# EAGLE design M628A (EAGLE 6.6.0)
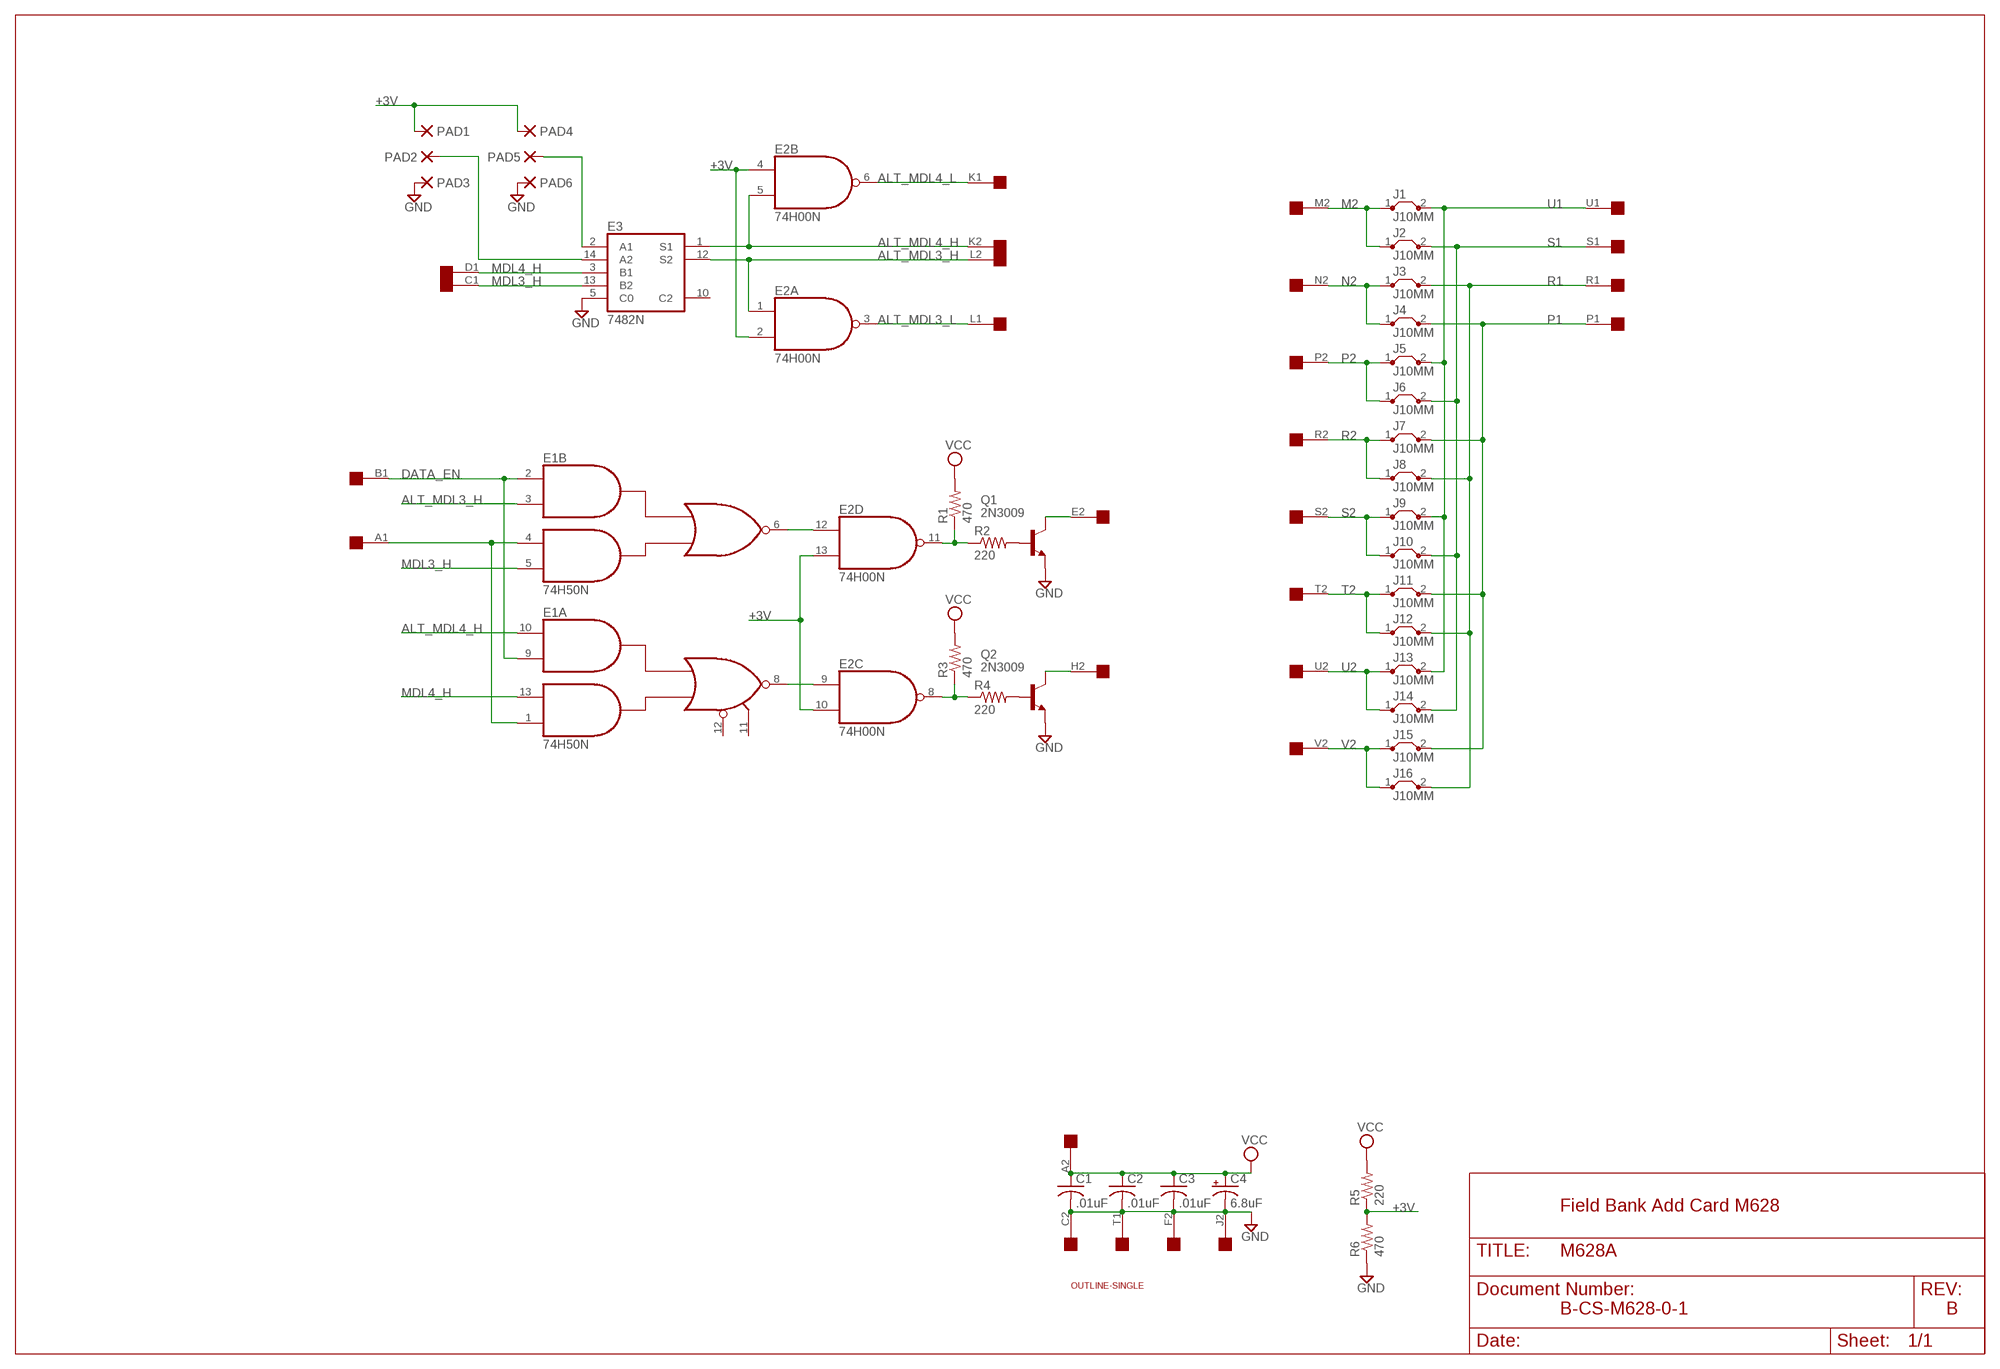
[diagram p0: schematic, sheet 1]

## Parts
C1  .01uF  C-US050-025X075  [C050-025X075]
C2  .01uF  C-US050-025X075  [C050-025X075]
C3  .01uF  C-US050-025X075  [C050-025X075]
C4  6.8uF  CPOL-USE20-8AXIAL  [E12-8]
E1  74H50N  7450N  [DIL14]
E2  74H00N  7400N  [DIL14]
E3  7482N  [DIL14]
J1  J10MM  [10]
J2  J10MM  [10]
J3  J10MM  [10]
J4  J10MM  [10]
J5  J10MM  [10]
J6  J10MM  [10]
J7  J10MM  [10]
J8  J10MM  [10]
J9  J10MM  [10]
J10  J10MM  [10]
J11  J10MM  [10]
J12  J10MM  [10]
J13  J10MM  [10]
J14  J10MM  [10]
J15  J10MM  [10]
J16  J10MM  [10]
PAD1  PAD-0420  [0420]
PAD2  PAD-0420  [0420]
PAD3  PAD-0420  [0420]
PAD4  PAD-0420  [0420]
PAD5  PAD-0420  [0420]
PAD6  PAD-0420  [0420]
Q1  2N3009  2N2102  [TO5]
Q2  2N3009  2N2102  [TO5]
R1  470  R-US_0207/10  [0207/10]
R2  220  R-US_0207/10  [0207/10]
R3  470  R-US_0207/10  [0207/10]
R4  220  R-US_0207/10  [0207/10]
R5  220  R-US_0207/10  [0207/10]
R6  470  R-US_0207/10  [0207/10]
U$1  OUTLINE-SINGLE  [SINGLE]
U$2  SINGLE  [EDGE-CON2]

## Nets
+3V [Supply]: E2.2(A:I1) E2.4(B:I0) E2.10(C:I1) E2.13(D:I1) PAD1.P$1(P) PAD4.P$1(P) R5.1 R6.2
ALT_MDL3_H: E1.3(B:I2) E2.1(A:I0) E3.12(S2) U$2.L2
ALT_MDL3_L: E2.3(A:O) U$2.L1
ALT_MDL4_H: E1.10(A:I1) E2.5(B:I1) E3.1(S1) U$2.K2
ALT_MDL4_L: E2.6(B:O) U$2.K1
DATA_EN: E1.2(B:I1) E1.9(A:I2) U$2.B1
GND [Supply]: C1.2 C2.2 C3.2 C4.- E3.5(C0) PAD3.P$1(P) PAD6.P$1(P) Q1.1(E) Q2.1(E) R6.1 U$2.C2 U$2.F2 U$2.J2 U$2.T1
M2: J1.1 J2.1 U$2.M2
MDL3_H: E1.5(B:I4) E3.13(B2) U$2.C1
MDL4_H: E1.13(A:I3) E3.3(B1) U$2.D1
N2: J3.1 J4.1 U$2.N2
N$1: E3.2(A1) PAD5.P$1(P)
N$2: E3.14(A2) PAD2.P$1(P)
N$3: E1.8(A:O) E2.9(C:I0)
N$4: E1.1(A:I4) E1.4(B:I3) U$2.A1
N$5: E1.6(B:O) E2.12(D:I0)
N$6: E2.11(D:O) R1.1 R2.1
N$7: E2.8(C:O) R3.1 R4.1
N$8: Q1.2(B) R2.2
N$9: Q2.2(B) R4.2
N$10: Q1.3(C) U$2.E2
N$11: Q2.3(C) U$2.H2
P1: J4.2 J7.2 J11.2 J15.2 U$2.P1
P2: J5.1 J6.1 U$2.P2
R1: J3.2 J8.2 J12.2 J16.2 U$2.R1
R2: J7.1 J8.1 U$2.R2
S1: J2.2 J6.2 J10.2 J14.2 U$2.S1
S2: J9.1 J10.1 U$2.S2
T2: J11.1 J12.1 U$2.T2
U1: J1.2 J5.2 J9.2 J13.2 U$2.U1
U2: J13.1 J14.1 U$2.U2
V2: J15.1 J16.1 U$2.V2
VCC [Supply]: C1.1 C2.1 C3.1 C4.+ R1.2 R3.2 R5.2 U$2.A2
Unconnected: E1.11(A:I6) E1.12(A:I5) E3.6 E3.7 E3.8 E3.9 E3.10(C2) U$2.B2 U$2.D2 U$2.E1 U$2.F1 U$2.H1 U$2.J1 U$2.M1 U$2.N1 U$2.V1

## Notes on the sheet
- Field Bank Add Card M628
- B-CS-M628-0-1 | B

## Power pins joined to a net without a drawn wire
GND: E1.7(P:GND) E2.7(P:GND) E3.11(GND)
VCC: E1.14(P:VCC) E2.14(P:VCC) E3.4(VCC)

## Library data of the parts
C1-C3 = rcl:C-US: CAPACITOR, American symbol
C4 = dec-con:CPOL-USE20-8AXIAL: A 0.8 inch electrolytic.
E1 = dec-con:74*50: 4-2-3-2 input AND OR INVERTER gates
E2 = 74xx-us:74*00: Quad 2-input NAND gate
E3 = dec-con:74*82: 2-bit binary full ADDER Has the wrong GND pin in other libraries.
J1-J16 = jumper:J: Bridge
PAD1-PAD6 = dec-con:PAD: WIRE PAD Standard US Drill Sizes
Q1 Q2 = transistor-npn:2N2102: NPN Transistor
R1-R6 = rcl:R-US_: RESISTOR, American symbol
U$1 = dec-con:OUTLINE-*: Board outlines for DEC boards.
U$2 = dec-con:SINGLE: Single-Height DEC board

## Net classes
1 Supply: width 0.813 mm

## Board
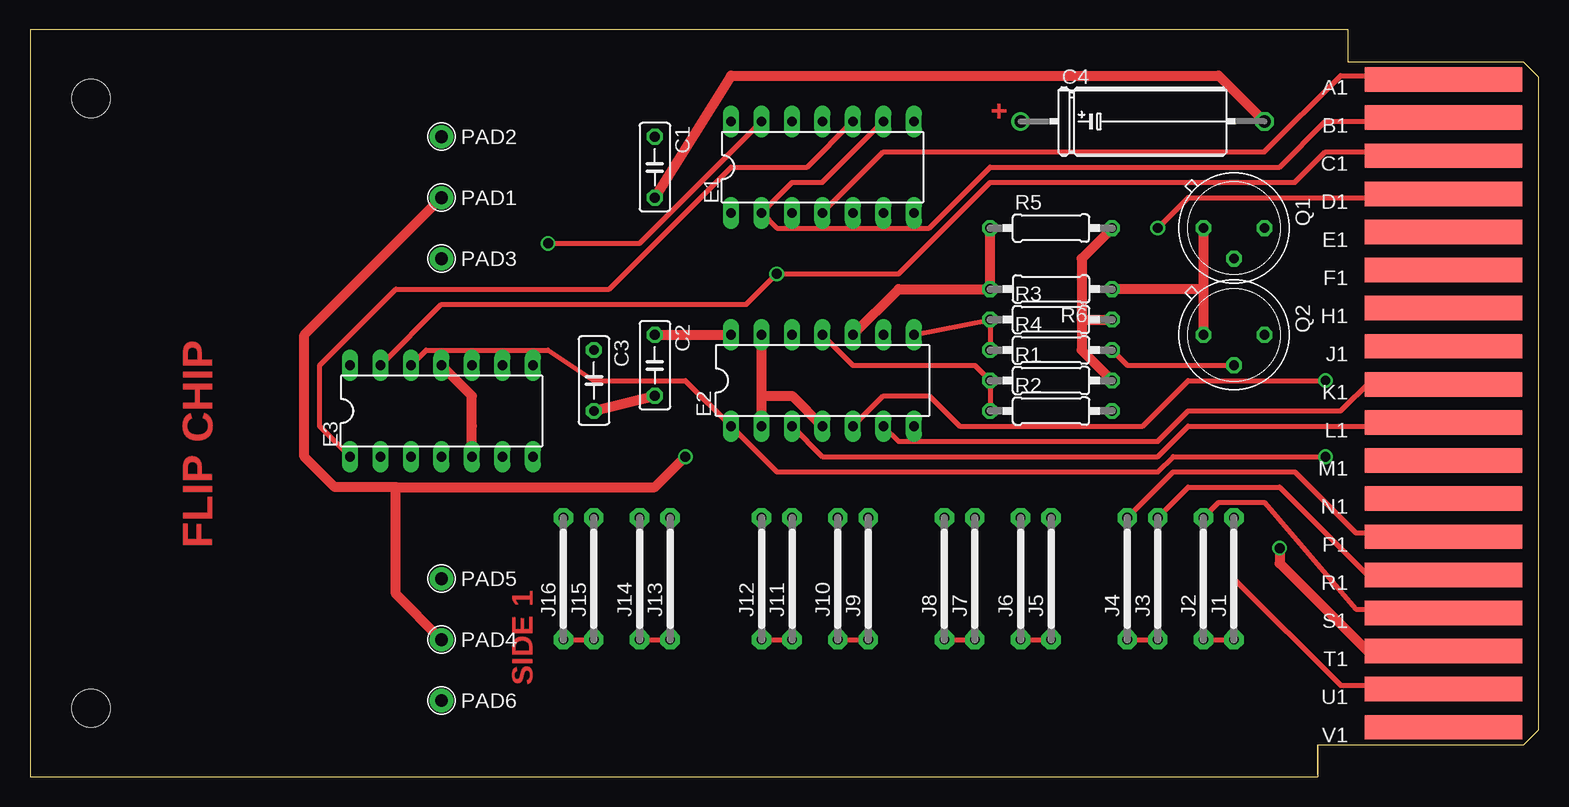
[diagram p1: board, top side]
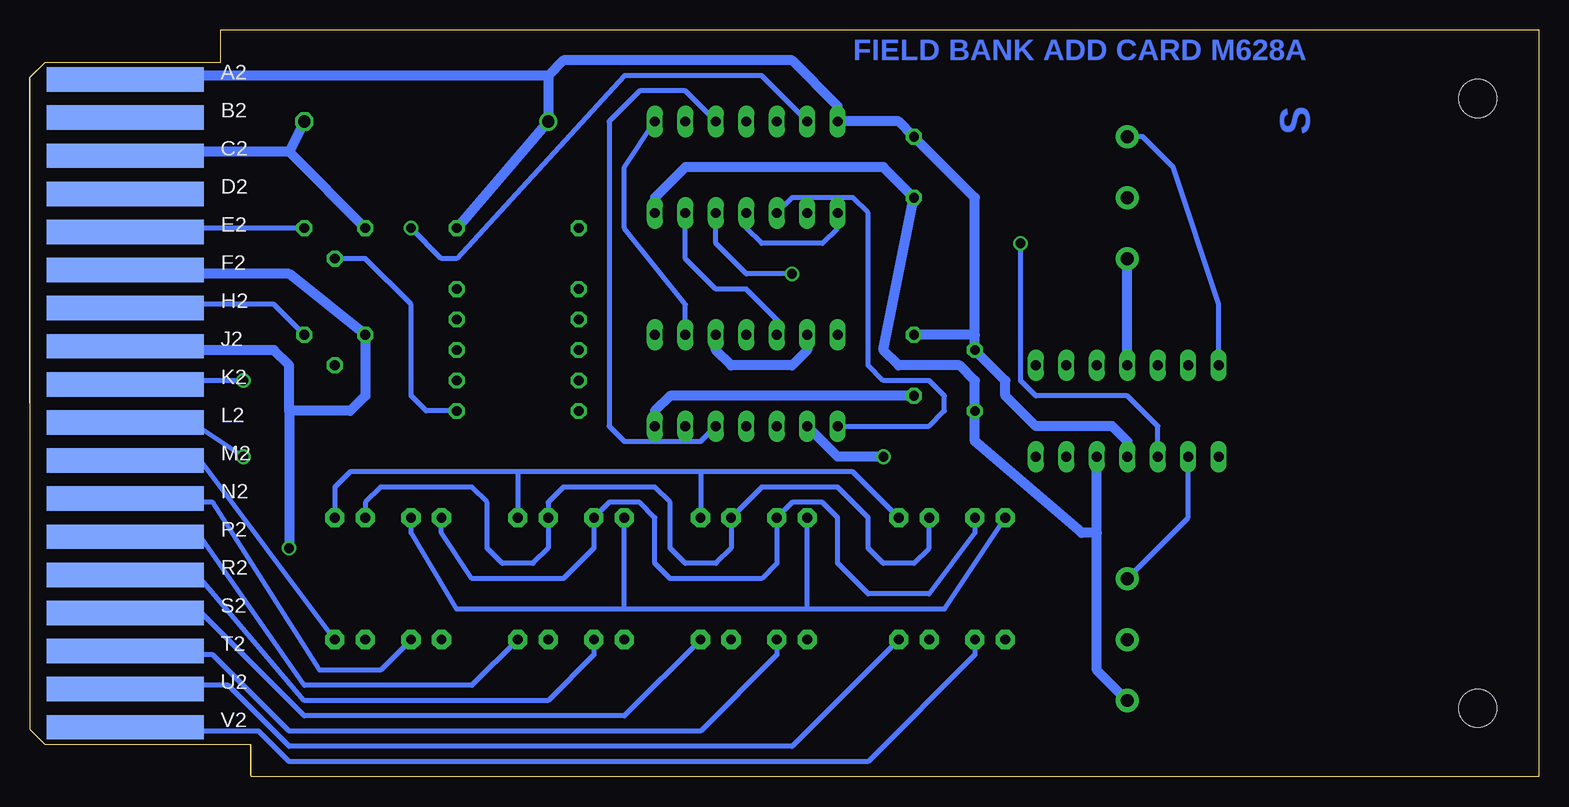
[diagram p2: board, bottom side, seen from below]

Size 125.73 x 62.23 mm. Coordinates in mm from the lower left corner, seen from the top.
Copper layers (1+16): Top 0.035mm / dielectric 1.5mm / Bottom 0.035mm
Design rules "16mils": minimum track width 16mil, minimum drill 32mil, track to track 15mil, track to pad 10mil, pad to pad 10mil, via to via 10mil, smd to smd 10mil, copper to edge 13mil, drill to drill 10mil, minimum pad ring 10mil, minimum via ring 8mil, stop-mask expansion 0mil, vias tented up to drill 0mil, thermal gap 10mil

### Footprints (pad centres in the part's own frame; a part is rotated, then mirrored left to right if it is on the bottom)
C050-025X075 = drill 0.813 octagon: 1 -2.54,0; 2 2.54,0
E12-8 = drill 1.016: + -10.16,0 | drill 1.016 octagon: - 10.16,0
DIL14 = drill 0.813 long: 1 -7.62,-3.81; 2 -5.08,-3.81; 3 -2.54,-3.81; 4 0,-3.81; 5 2.54,-3.81; 6 5.08,-3.81; 7 7.62,-3.81; 8 7.62,3.81; 9 5.08,3.81; 10 2.54,3.81; 11 0,3.81; 12 -2.54,3.81; 13 -5.08,3.81; 14 -7.62,3.81
10 = drill 0.813 pad 1.6 octagon: 1 -5.08,0; 2 5.08,0
0420 = drill 1.067 pad 1.93: P$1 0,0
TO5 = drill 0.813 octagon: 1 0,-2.54; 2 2.54,0; 3 0,2.54
0207/10 = drill 0.813 octagon: 1 -5.08,0; 2 5.08,0
SINGLE = hole 3.175: 120.65,56.515; 120.65,5.715
EDGE-CON2 = smd 13.106 x 2.032: A1 7.938,4.128; B1 7.938,7.303; C1 7.938,10.477; D1 7.938,13.652; E1 7.938,16.828; F1 7.938,20.003; H1 7.938,23.177; J1 7.938,26.352; K1 7.938,29.527; L1 7.938,32.703; M1 7.938,35.877; N1 7.938,39.053; P1 7.938,42.227; R1 7.938,45.403; S1 7.938,48.578; T1 7.938,51.752; U1 7.938,54.928; V1 7.938,58.102 | smd 13.106 x 2.032 bottom: A2 7.938,4.128; B2 7.938,7.303; C2 7.938,10.477; D2 7.938,13.652; E2 7.938,16.828; F2 7.938,20.003; H2 7.938,23.177; J2 7.938,26.352; K2 7.938,29.527; L2 7.938,32.703; M2 7.938,35.877; N2 7.938,39.053; P2 7.938,42.227; R2 7.938,45.403; S2 7.938,48.578; T2 7.938,51.752; U2 7.938,54.928; V2 7.938,58.102

### Placement (x,y rotation side)
C1  52.07,50.8 270 top
C2  52.07,34.29 270 top
C3  46.99,33.02 270 top
C4  92.71,54.61 0 top
E1  66.04,50.8 0 top
E2  66.04,33.02 0 top
E3  34.29,30.48 0 top
J1  100.33,16.51 90 top
J2  97.79,16.51 90 top
J3  93.98,16.51 90 top
J4  91.44,16.51 90 top
J5  85.09,16.51 90 top
J6  82.55,16.51 90 top
J7  78.74,16.51 90 top
J8  76.2,16.51 90 top
J9  69.85,16.51 90 top
J10  67.31,16.51 90 top
J11  63.5,16.51 90 top
J12  60.96,16.51 90 top
J13  53.34,16.51 90 top
J14  50.8,16.51 90 top
J15  46.99,16.51 90 top
J16  44.45,16.51 90 top
PAD1  34.29,48.26 0 top
PAD2  34.29,53.34 0 top
PAD3  34.29,43.18 0 top
PAD4  34.29,11.43 0 top
PAD5  34.29,16.51 0 top
PAD6  34.29,6.35 0 top
Q1  100.33,45.72 270 top
Q2  100.33,36.83 270 top
R1  85.09,33.02 0 top
R2  85.09,30.48 0 top
R3  85.09,38.1 0 top
R4  85.09,35.56 0 top
R5  85.09,45.72 0 top
R6  85.09,40.64 180 top
U$1  125.73,62.23 180 top
U$2  125.73,62.23 180 top
U$3  [FLIPCHIP]  10.16,0 0 top

### Tracks (layer width: path | path; a pad name or v marks a point on that pad's centre or on a via)
+3V  (via drill 0.81)
  Top 0.813: E2.10 72.39,40.64 R6.2 R5.1 | v54.61,26.67 52.07,24.13 30.48,24.13 | 30.48,24.13 25.4,24.13 22.86,26.67 22.86,36.83 PAD1.P$1 | PAD4.P$1 30.48,15.24 30.48,24.13 | E2.2 60.96,31.75 | 60.96,31.75 E2.13 | E2.4 63.5,31.75 60.96,31.75
  Bottom 0.813: E2.2 58.42,26.67 v54.61,26.67 | E2.13 60.96,35.56 62.23,34.29 67.31,34.29 68.58,35.56 E2.10
ALT_MDL3_H  (via drill 0.81)
  Top 0.406: E3.12 33.02,35.56 43.18,35.56 46.99,33.02 54.61,33.02 E2.1 62.23,25.4 93.98,25.4 95.25,26.67 v107.95,26.67
  Bottom 0.406: E2.1 50.8,29.21 49.53,30.48 49.53,31.75 50.8,33.02 54.61,33.02 55.88,34.29 55.88,46.99 57.15,48.26 62.23,48.26 E1.3 | U$2.L2 116.84,29.21 111.76,29.21 v107.95,26.67
ALT_MDL3_L
  Top 0.406: U$2.L1 116.84,29.21 96.52,29.21 93.98,26.67 66.04,26.67 E2.3
ALT_MDL4_H  (via drill 0.81)
  Top 0.406: E3.1 24.13,29.21 24.13,34.29 30.48,40.64 48.26,40.64 58.42,50.8 64.77,50.8 E1.10 | v107.95,33.02 96.52,33.02 92.71,29.21 77.47,29.21 74.93,31.75 71.12,31.75 E2.5
  Bottom 0.406: E1.10 71.12,57.15 74.93,57.15 77.47,54.61 77.47,29.21 76.2,27.94 69.85,27.94 E2.5 | U$2.K2 116.84,33.02 v107.95,33.02
ALT_MDL4_L
  Top 0.406: U$2.K1 116.84,33.02 111.76,33.02 109.22,30.48 96.52,30.48 93.98,27.94 72.39,27.94 E2.6
DATA_EN
  Top 0.406: U$2.B1 116.84,54.61 107.95,54.61 104.14,50.8 80.01,50.8 74.93,45.72 62.23,45.72 E1.2 63.5,49.53 66.04,49.53 E1.9
GND  (via drill 0.81)
  Top 0.813: U$2.T1 116.84,10.16 111.76,10.16 104.14,17.78 v104.14,19.05 | C4.- 99.06,58.42 58.42,58.42 C1.2 | Q1.1 97.79,40.64 | 97.79,40.64 Q2.1 | 97.79,40.64 R6.1 | C3.2 C2.2 | E3.11 36.83,31.75 36.83,29.21 E3.5
  Bottom 0.813: U$2.F2 116.84,41.91 104.14,41.91 Q2.1 97.79,31.75 99.06,30.48 104.14,30.48 | 104.14,30.48 v104.14,19.05 | U$2.J2 116.84,35.56 105.41,35.56 104.14,34.29 104.14,30.48 | U$2.C2 116.84,52.07 104.14,52.07 | 104.14,52.07 Q1.1 | C4.- 104.14,52.07 | 36.83,20.32 36.83,8.89 PAD6.P$1 | 36.83,20.32 E3.5 | 36.83,20.32 38.1,20.32 46.99,27.94 C3.2 46.99,33.02 48.26,34.29 53.34,34.29 54.61,35.56 C1.2 54.61,50.8 71.12,50.8 73.66,48.26 E1.7 | E2.7 73.66,30.48 72.39,31.75 C2.2 | E3.11 PAD3.P$1
M2
  Top 0.406: J2.1 J1.1
  Bottom 0.406: U$2.M2 116.84,26.67 111.76,26.67 J1.1
MDL3_H  (via drill 0.81)
  Top 0.406: E3.13 34.29,39.37 59.69,39.37 v62.23,41.91 72.39,41.91 80.01,49.53 105.41,49.53 107.95,52.07 116.84,52.07 U$2.C1
  Bottom 0.406: E1.5 68.58,44.45 66.04,41.91 v62.23,41.91
MDL4_H  (via drill 0.81)
  Top 0.406: v43.18,44.45 50.8,44.45 E1.13 | U$2.D1 116.84,48.26 96.52,48.26 v93.98,45.72
  Bottom 0.406: E3.3 31.75,29.21 34.29,31.75 41.91,31.75 43.18,33.02 v43.18,44.45 | E1.13 64.77,58.42 76.2,58.42 90.17,43.18 91.44,43.18 v93.98,45.72
N2
  Top 0.406: J4.1 J3.1
  Bottom 0.406: J3.1 96.52,8.89 101.6,8.89 110.49,22.86 116.84,22.86 U$2.N2
N$1
  Bottom 0.406: PAD5.P$1 29.21,21.59 E3.2
N$2
  Bottom 0.406: PAD2.P$1 33.02,53.34 30.48,50.8 26.67,39.37 E3.14
N$3
  Bottom 0.406: E2.9 71.12,39.37 76.2,45.72 76.2,50.8 E1.8
N$4
  Top 0.406: U$2.A1 116.84,58.42 109.22,58.42 102.87,52.07 71.12,52.07 E1.4
  Bottom 0.406: E1.1 58.42,45.72 59.69,44.45 64.77,44.45 66.04,45.72 E1.4
N$5
  Bottom 0.406: E2.12 63.5,38.1 66.04,40.64 68.58,40.64 71.12,43.18 E1.6
N$6
  Top 0.406: R2.1 R1.1 78.74,34.29 68.58,34.29 E2.11
N$7
  Top 0.406: E2.8 R3.1 R4.1
N$8
  Bottom 0.406: R2.2 92.71,30.48 93.98,31.75 93.98,39.37 97.79,43.18 Q1.2
N$9
  Top 0.406: R4.2 91.44,34.29 Q2.2
N$10
  Bottom 0.406: U$2.E2 116.84,45.72 Q1.3
N$11
  Bottom 0.406: U$2.H2 116.84,39.37 105.41,39.37 Q2.3
P1
  Top 0.406: J4.2 95.25,25.4 105.41,25.4 110.49,20.32 116.84,20.32 U$2.P1
  Bottom 0.406: J15.2 46.99,20.32 50.8,15.24 55.88,15.24 58.42,17.78 58.42,21.59 59.69,22.86 62.23,22.86 J11.2 63.5,17.78 64.77,16.51 72.39,16.51 73.66,17.78 73.66,21.59 74.93,22.86 77.47,22.86 J7.2 78.74,19.05 81.28,16.51 88.9,16.51 91.44,20.32 J4.2
P2
  Top 0.406: J6.1 J5.1
  Bottom 0.406: J5.1 88.9,7.62 102.87,7.62 111.76,20.32 116.84,20.32 117.17,19.99 U$2.P2
R1
  Top 0.406: J3.2 96.52,24.13 104.14,24.13 111.76,16.51 116.84,16.51 U$2.R1
  Bottom 0.406: J16.2 49.53,13.97 60.96,13.97 | 60.96,13.97 J12.2 | 76.2,13.97 J8.2 | 60.96,13.97 76.2,13.97 | J3.2 93.98,20.32 90.17,13.97 76.2,13.97
R2
  Top 0.406: J8.1 J7.1
  Bottom 0.406: J7.1 78.74,10.16 82.55,6.35 102.87,6.35 111.51,16.51 116.84,16.51 117.17,16.84 U$2.R2
S1
  Top 0.406: J2.2 99.06,22.86 102.87,22.86 110.49,13.97 111.76,13.97 116.84,13.97 U$2.S1
  Bottom 0.406: J14.2 50.8,19.05 52.07,17.78 54.61,17.78 55.88,19.05 55.88,21.59 58.42,24.13 64.77,24.13 J10.2 67.31,19.05 68.58,17.78 71.12,17.78 72.39,19.05 72.39,22.86 73.66,24.13 81.28,24.13 82.55,22.86 J6.2 82.55,19.05 83.82,17.78 86.36,17.78 87.63,19.05 87.63,22.86 88.9,24.13 96.52,24.13 97.79,22.86 J2.2
S2
  Top 0.406: J10.1 J9.1
  Bottom 0.406: J9.1 76.2,5.08 102.87,5.08 111.76,13.97 116.84,13.97 117.14,13.66 U$2.S2
T2
  Top 0.406: J12.1 J11.1
  Bottom 0.406: J11.1 63.5,10.16 69.85,3.81 104.14,3.81 110.49,10.16 116.84,10.16 117.17,10.49 U$2.T2
U1
  Top 0.406: U$2.U1 116.84,7.62 109.22,7.62 100.33,16.51 J1.2
  Bottom 0.406: J13.2 57.15,25.4 69.85,25.4 | 69.85,25.4 J9.2 | 85.09,25.4 J5.2 | 69.85,25.4 85.09,25.4 | J1.2 100.33,24.13 99.06,25.4 85.09,25.4
U2
  Top 0.406: J14.1 J13.1
  Bottom 0.406: J13.1 62.23,2.54 104.14,2.54 109.22,7.62 116.84,7.62 117.2,7.26 U$2.U2
V2
  Top 0.406: J16.1 J15.1
  Bottom 0.406: J15.1 46.99,10.16 55.88,1.27 104.14,1.27 106.68,3.81 116.84,3.81 117.23,4.2 U$2.V2
VCC
  Top 0.813: R5.2 87.63,43.18 87.63,38.1 | 87.63,38.1 87.63,35.56 R1.2 | 87.63,38.1 R3.2 | C2.1 E2.14
  Bottom 0.813: U$2.A2 116.84,58.42 82.55,58.42 | 82.55,58.42 C4.+ R5.2 | 82.55,58.42 81.28,59.69 62.23,59.69 58.42,55.88 E1.14 53.34,54.61 C1.1 46.99,48.26 46.99,36.83 | 46.99,36.83 C3.1 44.45,33.02 44.45,31.75 41.91,29.21 35.56,29.21 34.29,27.94 E3.4 | 46.99,36.83 C2.1

### Text on the board
Top: + | SIDE 1
Bottom: FIELD BANK ADD CARD M628A | S